# EAGLE schematic Schematic (EAGLE 7.7.0)
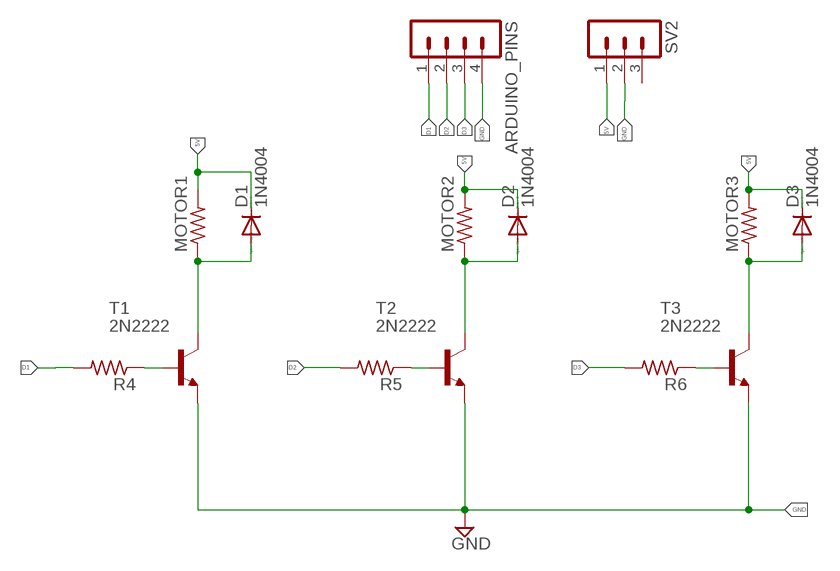
[diagram p0: schematic, sheet 1]

## Parts
ARDUINO_PINS  MA04-1  [MA04-1]
D1  1N4004  [DO41-10]
D2  1N4004  [DO41-10]
D3  1N4004  [DO41-10]
MOTOR1  R-US_0207/12  [0207/12]
MOTOR2  R-US_0207/12  [0207/12]
MOTOR3  R-US_0207/12  [0207/12]
R4  R-US_0207/12  [0207/12]
R5  R-US_0207/12  [0207/12]
R6  R-US_0207/12  [0207/12]
SV2  MA03-1  [MA03-1]
T1  2N2222  [TO18]
T2  2N2222  [TO18]
T3  2N2222  [TO18]

## Nets
5V: D1.C D2.C D3.C MOTOR1.2 MOTOR2.2 MOTOR3.2 SV2.1
D1: ARDUINO_PINS.1 R4.2
D2: ARDUINO_PINS.2 R5.2
D3: ARDUINO_PINS.3 R6.2
GND: ARDUINO_PINS.4 SV2.2 T1.1(E) T2.1(E) T3.1(E)
MOTOR2: D2.A MOTOR2.1 T2.3(C)
MOTOR3: D3.A MOTOR3.1 T3.3(C)
N$7: D1.A MOTOR1.1 T1.3(C)
N$8: R4.1 T1.2(B)
N$11: R6.1 T3.2(B)
N$13: R5.1 T2.2(B)
Unconnected: SV2.3

## Library data of the parts
ARDUINO_PINS = con-lstb:MA04-1: PIN HEADER; OC_FARNELL: unknown; OC_NEWARK: unknown
D1-D3 = diode:1N4004: DIODE general purpose rectifier, 1 A
MOTOR1-MOTOR3 R4-R6 = resistor:R-US_: RESISTOR, American symbol
SV2 = con-lstb:MA03-1: PIN HEADER; OC_FARNELL: unknown; OC_NEWARK: unknown
T1-T3 = transistor-neu-to92:2N2222: NPN TRANSISTOR

## Module 1
Ports: 

### Library data of the parts